# EAGLE schematic BBB_LEDs (EAGLE 6.6.0)
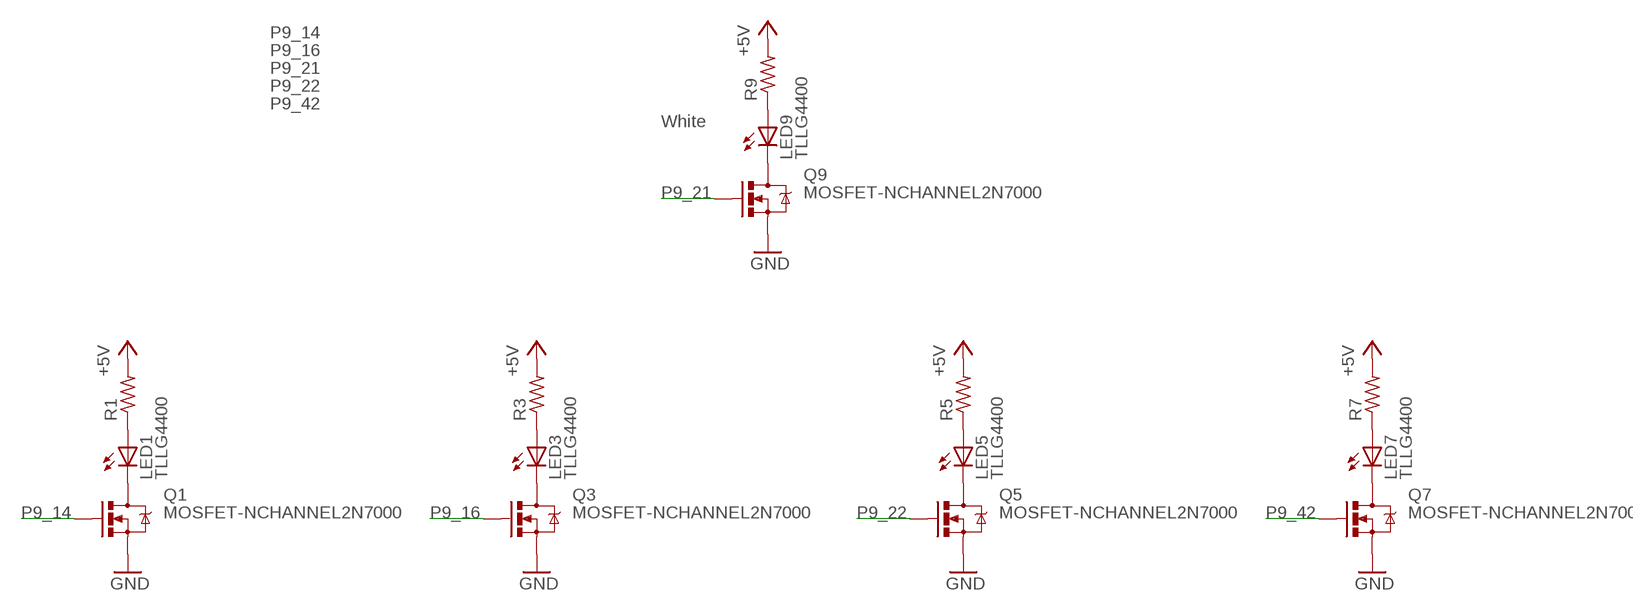
[diagram p0: schematic, sheet 1]

## Parts
LED1  TLLG4400  [LED3MM]
LED3  TLLG4400  [LED3MM]
LED5  TLLG4400  [LED3MM]
LED7  TLLG4400  [LED3MM]
LED9  TLLG4400  [LED3MM]
Q1  MOSFET-NCHANNEL2N7000  [TO-92]
Q3  MOSFET-NCHANNEL2N7000  [TO-92]
Q5  MOSFET-NCHANNEL2N7000  [TO-92]
Q7  MOSFET-NCHANNEL2N7000  [TO-92]
Q9  MOSFET-NCHANNEL2N7000  [TO-92]
R1  R-US_0207/10  [0207/10]
R3  R-US_0207/10  [0207/10]
R5  R-US_0207/10  [0207/10]
R7  R-US_0207/10  [0207/10]
R9  R-US_0207/10  [0207/10]

## Nets
+5V: R1.2 R3.2 R5.2 R7.2 R9.2
GND: Q1.1(S) Q3.1(S) Q5.1(S) Q7.1(S) Q9.1(S)
N$1: LED1.K(C) Q1.3(D)
N$2: LED1.A R1.1
N$6: LED3.K(C) Q3.3(D)
N$7: LED3.A R3.1
N$10: LED5.K(C) Q5.3(D)
N$11: LED5.A R5.1
N$14: LED7.K(C) Q7.3(D)
N$15: LED7.A R7.1
N$18: LED9.K(C) Q9.3(D)
N$19: LED9.A R9.1
P9_14: Q1.2(G)
P9_16: Q3.2(G)
P9_21: Q9.2(G)
P9_22: Q5.2(G)
P9_42: Q7.2(G)

## Notes on the sheet
- P9_14
- P9_16
- P9_21
- P9_22
- P9_42
- White

## Library data of the parts
LED1 LED3 LED5 LED7 LED9 = led:TLLG4400: Low Current (2mA) LED 3 mm Tinted Diffused Package color GREEN Source: Data sheet <http://www.farnell.com/datasheets/391098.pdf>; MF: VISHAY SEMICONDUCTOR; OC_FARNELL: 1612435
Q1 Q3 Q5 Q7 Q9 = SparkFun-DiscreteSemi:MOSFET-NCHANNEL: Common NMOSFET Parts MFG P/N Store ID Prod ID FDD8780 TRANS-09984 SI7820DN TRANS-11055 FDS6630A IC-08089 2N7002PW TRANS-11151 FQP30N06L COM-10213 TRANS-10060 BSS123LT1G TRANS-08345 BSS138 TRANS-00830 BS170 2N7000
R1 R3 R5 R7 R9 = rcl:R-US_: RESISTOR, American symbol